# Altium schematic sheet XQuang_ViTri.SchDoc
size A1
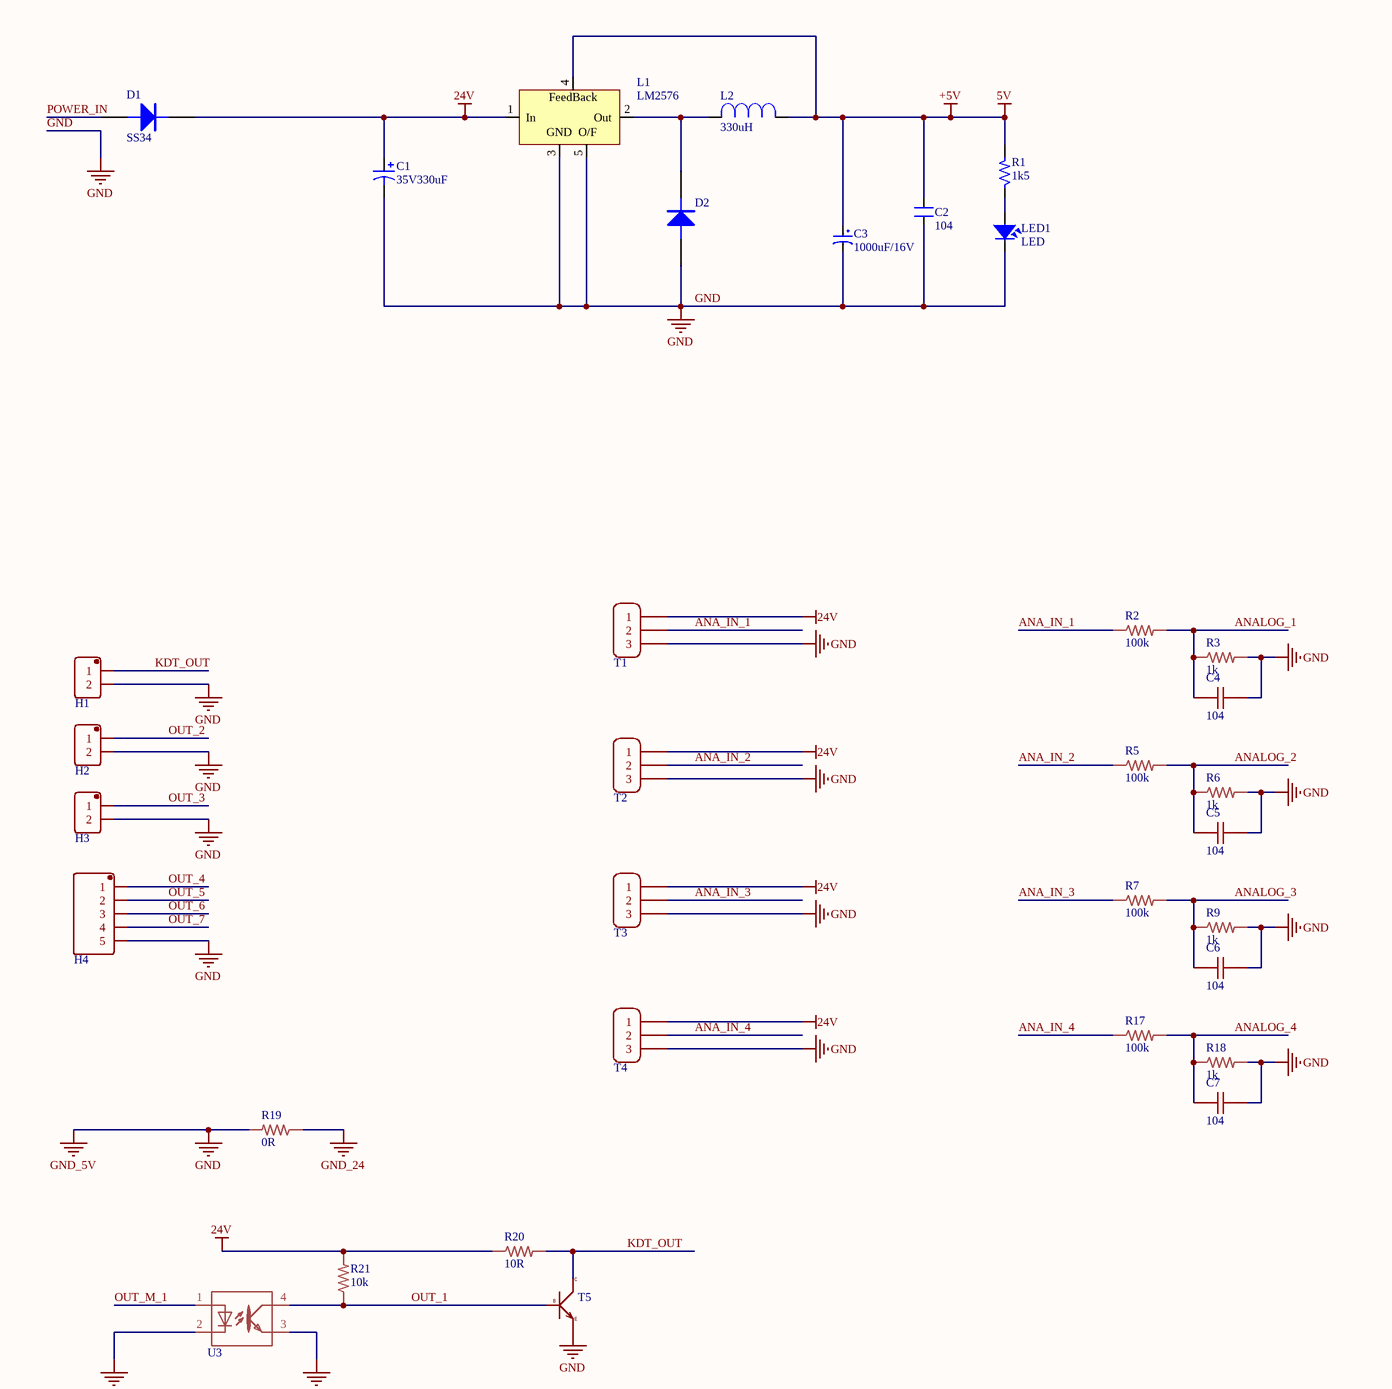
[diagram p0: XQuang_ViTri.SchDoc, top left]
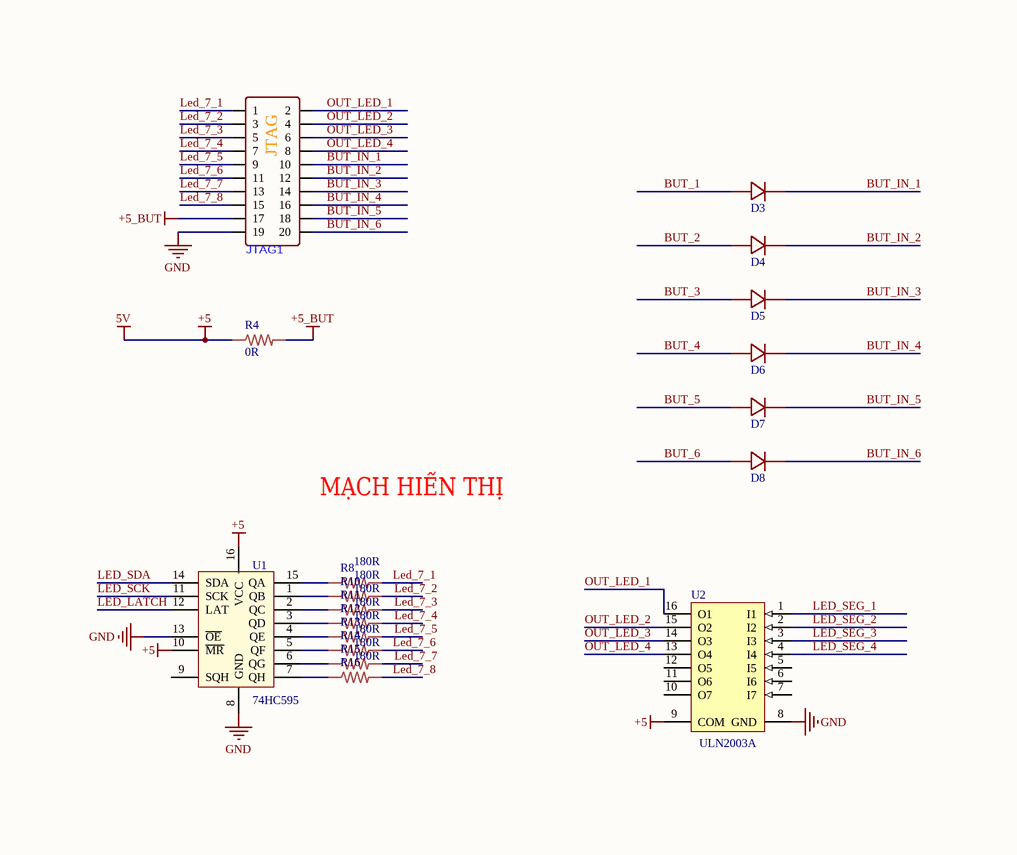
[diagram p1: XQuang_ViTri.SchDoc, top right]
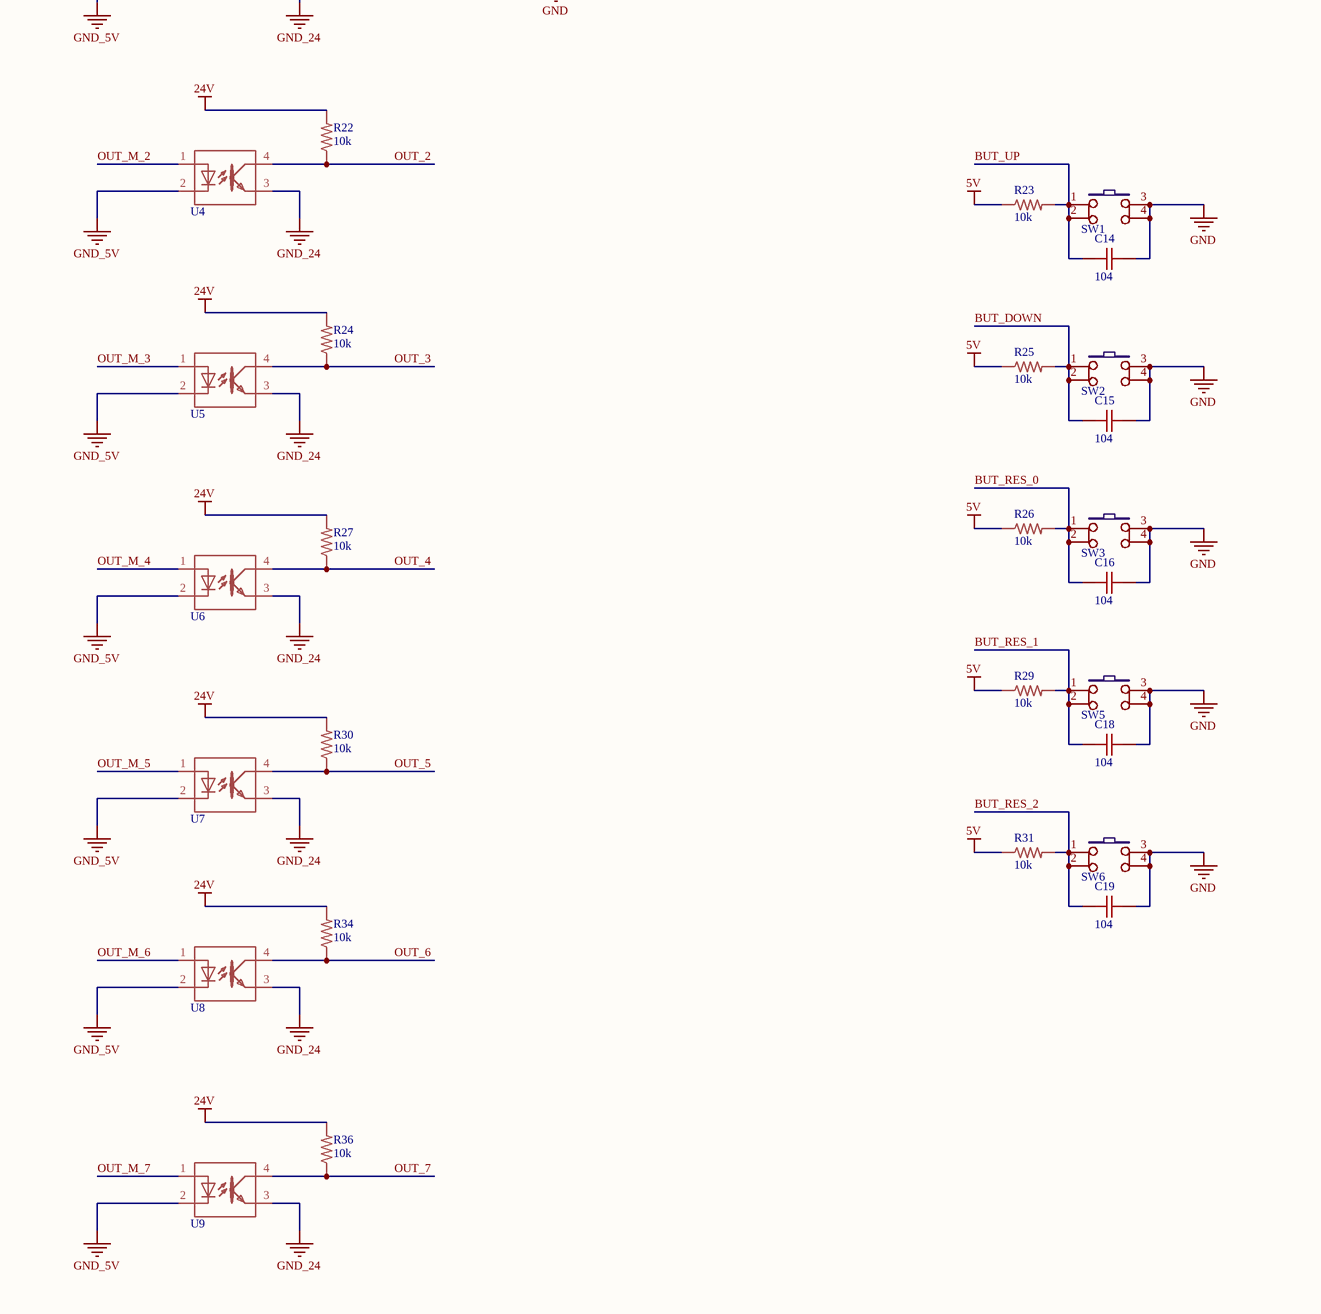
[diagram p2: XQuang_ViTri.SchDoc, bottom left]
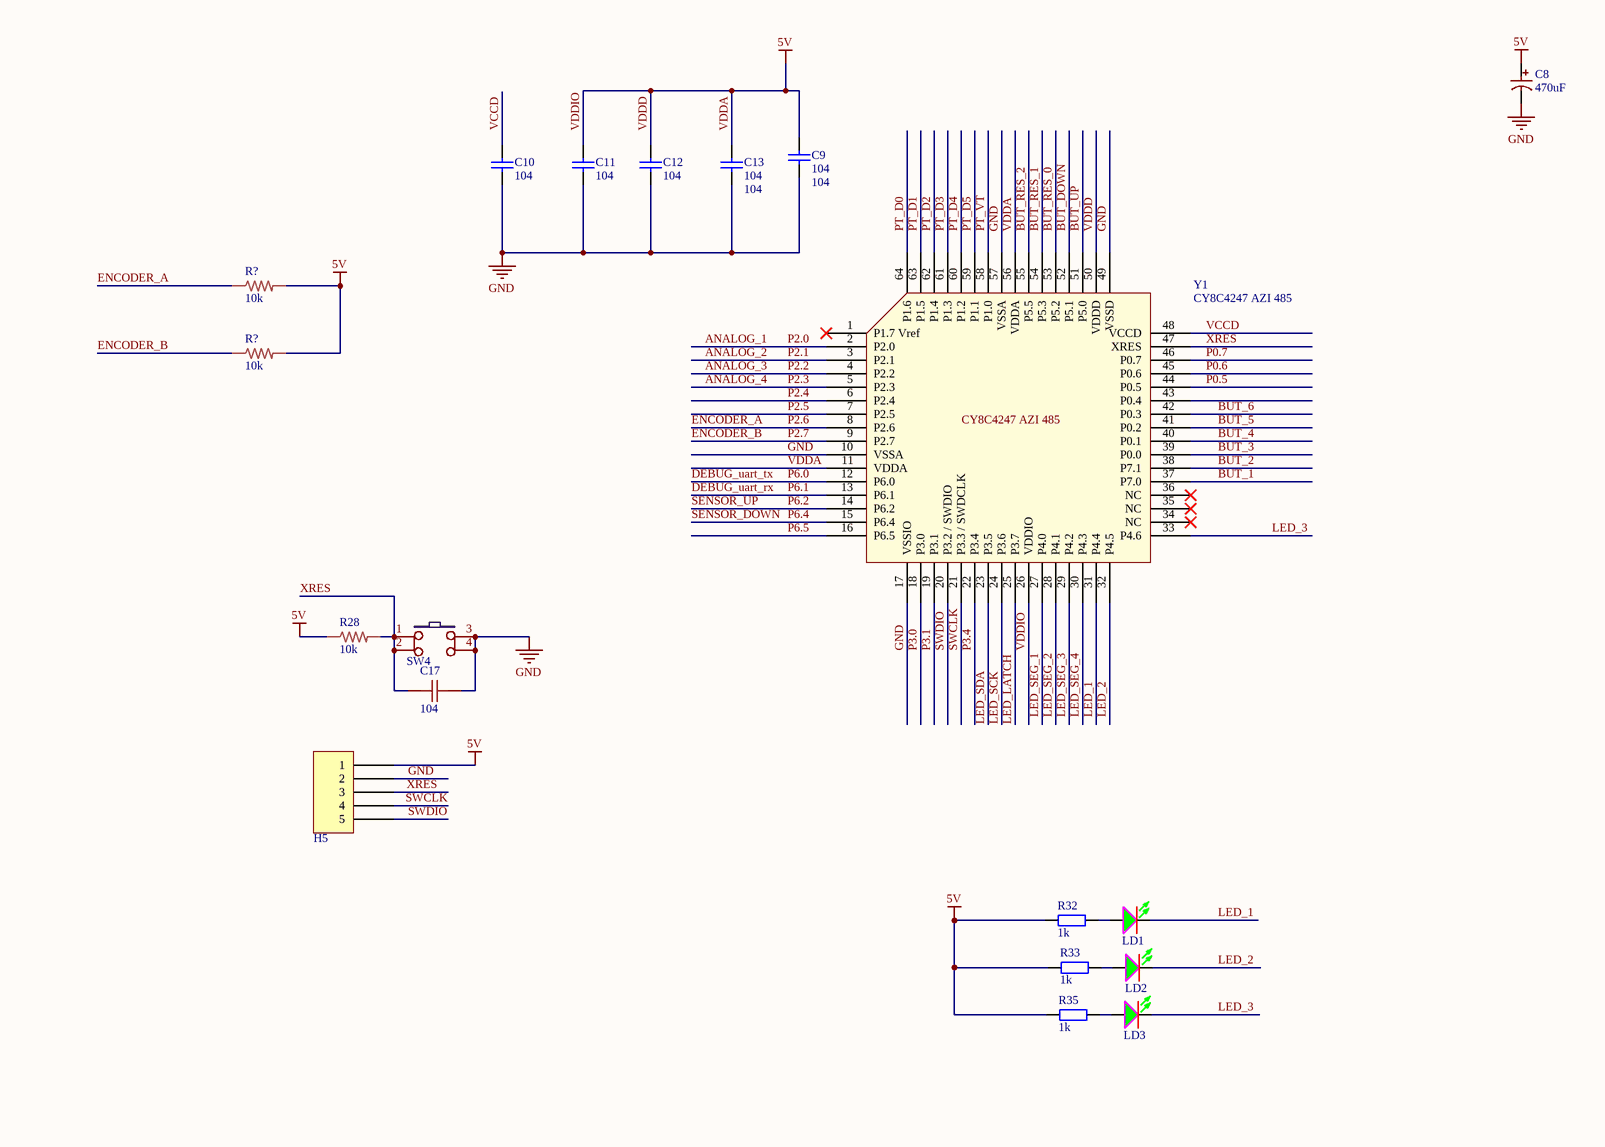
[diagram p3: XQuang_ViTri.SchDoc, bottom right]

## Parts
(Parts that share a designator on the sheet are numbered #1, #2 ... from top to bottom, then left to right.)
C1  35V330uF  [CAP POLY 220UF 16V]
C2  104  [Cap Non Pol 0805]
C3  1000uF/16V  [CAP-ALU-SMD-F]
C4  value 104  [CAP_SMD_1206]  (hidden comment: Cap_SMD)
C5  value 104  [CAP_SMD_1206]  (hidden comment: Cap_SMD)
C6  value 104  [CAP_SMD_1206]  (hidden comment: Cap_SMD)
C7  value 104  [CAP_SMD_1206]  (hidden comment: Cap_SMD)
C8  value 470uF  [Cap_Alu_470uF]  (hidden comment: Cap_Alu_470uF)
C9  104  [Cap_SMD_0805]
C10  104  [C0805]
C11  104  [C0805]
C12  104  [C0805]
C13  104  [Cap_SMD_0805]
C14  value 104  [CAP_SMD_1206]  (hidden comment: Cap_SMD)
C15  value 104  [CAP_SMD_1206]  (hidden comment: Cap_SMD)
C16  value 104  [CAP_SMD_1206]  (hidden comment: Cap_SMD)
C17  value 104  [CAP_SMD_1206]  (hidden comment: Cap_SMD)
C18  value 104  [CAP_SMD_1206]  (hidden comment: Cap_SMD)
C19  value 104  [CAP_SMD_1206]  (hidden comment: Cap_SMD)
D1  SS34  [SMB]
D2  (no value)  [SMA_ss56]
D3  1N4007  [Diode M7]  (value not drawn)
D4  1N4007  [Diode M7]  (value not drawn)
D5  1N4007  [Diode M7]  (value not drawn)
D6  1N4007  [Diode M7]  (value not drawn)
D7  1N4007  [Diode M7]  (value not drawn)
D8  1N4007  [Diode M7]  (value not drawn)
H1  Terminal2x5.08  [EDG2P508]  (value not drawn)
H2  Terminal2x5.08  [EDG2P508]  (value not drawn)
H3  Terminal2x5.08  [EDG2P508]  (value not drawn)
H4  Terminal5x5.08  [EDG5P508]  (value not drawn)
H5  Header 5  [Header 5]  (value not drawn)
JTAG1  JTAG  [JTAG_NG]  (value not drawn)
L1  LM2576  [LM2576_SMD]
L2  value 330uH  [Inductor DR127]  (hidden comment: Inductor DR127)
LD1  LED SMD  [LED3]  (value not drawn)
LD2  LED SMD  [LED3]  (value not drawn)
LD3  LED SMD  [LED3]  (value not drawn)
LED1  LED  [LED 1206/3216 BLUE]
R1  1k5  [Resistor 0805]
R2  value 100k  [Res_SMD_1206]  (hidden comment: Res_SMD)
R3  value 1k  [Res_SMD_1206]  (hidden comment: Res_SMD)
R4  value 0R  [Res_SMD_1206]  (hidden comment: Res_SMD)
R5  value 100k  [Res_SMD_1206]  (hidden comment: Res_SMD)
R6  value 1k  [Res_SMD_1206]  (hidden comment: Res_SMD)
R7  value 100k  [Res_SMD_1206]  (hidden comment: Res_SMD)
R8  value 180R  [Res_SMD_1206]  (hidden comment: Res_SMD)
R9  value 1k  [Res_SMD_1206]  (hidden comment: Res_SMD)
R10  value 180R  [Res_SMD_1206]  (hidden comment: Res_SMD)
R11  value 180R  [Res_SMD_1206]  (hidden comment: Res_SMD)
R12  value 180R  [Res_SMD_1206]  (hidden comment: Res_SMD)
R13  value 180R  [Res_SMD_1206]  (hidden comment: Res_SMD)
R14  value 180R  [Res_SMD_1206]  (hidden comment: Res_SMD)
R15  value 180R  [Res_SMD_1206]  (hidden comment: Res_SMD)
R16  value 180R  [Res_SMD_1206]  (hidden comment: Res_SMD)
R17  value 100k  [Res_SMD_1206]  (hidden comment: Res_SMD)
R18  value 1k  [Res_SMD_1206]  (hidden comment: Res_SMD)
R19  value 0R  [Res_SMD_1206]  (hidden comment: Res_SMD)
R20  value 10R  [RES_SMD_2512]  (hidden comment: Res_SMD)
R21  value 10k  [Res_SMD_1206]  (hidden comment: Res_SMD)
R22  value 10k  [Res_SMD_1206]  (hidden comment: Res_SMD)
R23  value 10k  [Res_SMD_1206]  (hidden comment: Res_SMD)
R24  value 10k  [Res_SMD_1206]  (hidden comment: Res_SMD)
R25  value 10k  [Res_SMD_1206]  (hidden comment: Res_SMD)
R26  value 10k  [Res_SMD_1206]  (hidden comment: Res_SMD)
R27  value 10k  [Res_SMD_1206]  (hidden comment: Res_SMD)
R28  value 10k  [Res_SMD_1206]  (hidden comment: Res_SMD)
R29  value 10k  [Res_SMD_1206]  (hidden comment: Res_SMD)
R30  value 10k  [Res_SMD_1206]  (hidden comment: Res_SMD)
R31  value 10k  [Res_SMD_1206]  (hidden comment: Res_SMD)
R32  1k  [Res_SMD_0805]
R33  1k  [Res_SMD_0805]
R34  value 10k  [Res_SMD_1206]  (hidden comment: Res_SMD)
R35  1k  [Res_SMD_0805]
R36  value 10k  [Res_SMD_1206]  (hidden comment: Res_SMD)
R?#1  value 10k  [Res_SMD_1206]  (hidden comment: Res_SMD)
R?#2  value 10k  [Res_SMD_1206]  (hidden comment: Res_SMD)
SW1  Button6x6  [Button6x6smd]  (value not drawn)
SW2  Button6x6  [Button6x6smd]  (value not drawn)
SW3  Button6x6  [Button6x6smd]  (value not drawn)
SW4  Button6x6  [Button6x6smd]  (value not drawn)
SW5  Button6x6  [Button6x6smd]  (value not drawn)
SW6  Button6x6  [Button6x6smd]  (value not drawn)
T1  Terminal B 3P  [Terminal-3p-381]  (value not drawn)
T2  Terminal B 3P  [Terminal-3p-381]  (value not drawn)
T3  Terminal B 3P  [Terminal-3p-381]  (value not drawn)
T4  Terminal B 3P  [Terminal-3p-381]  (value not drawn)
T5  TIP41C  [TO252]  (value not drawn)
U1  74HC595  [Sop16pin]
U2  ULN2003A  [SO-16]
U3  PC817  [PC817]  (value not drawn)
U4  PC817  [PC817]  (value not drawn)
U5  PC817  [PC817]  (value not drawn)
U6  PC817  [PC817]  (value not drawn)
U7  PC817  [PC817]  (value not drawn)
U8  PC817  [PC817]  (value not drawn)
U9  PC817  [PC817]  (value not drawn)
Y1  CY8C4247 AZI 485  [CY8C4247 AZI]

## Nets
24V: C1.1 D1.2 L1.1(In) R20.1 R21.2 R22.2 R24.2 R27.2 R30.2 R34.2 R36.2 T1.1 T2.1 T3.1 T4.1
+5_BUT: JTAG1.17 R4.2
GND: C1.2 C2.1 C3.2 C4.1 C5.1 C6.1 C7.1 C8.2 C9.2 C10.2 C11.2 C12.2 C13.2 C14.1 C15.1 C16.1 C17.1 C18.1 C19.1 D2.1 H1.2 H2.2 H3.2 H4.5 H5.2 JTAG1.19 L1.3(GND) L1.5(~{O}/F) LED1.2 R3.2 R6.2 R9.2 R18.2 R19.2 SW1.3 SW1.4 SW2.3 SW2.4 SW3.3 SW3.4 SW4.3 SW4.4 SW5.3 SW5.4 SW6.3 SW6.4 T1.3 T2.3 T3.3 T4.3 T5.3(C) U1.8(GND) U1.13(~{OE}) U2.8(GND) U3.2(C) U4.2(C) U5.2(C) U6.2(C) U7.2(C) U8.2(C) U9.2(C) Y1.10(VSSA) Y1.17(VSSIO) Y1.49(VSSD) Y1.57(VSSA)  [also labelled GND_5V]
GND_24: R19.1 U3.3(EMIT) U4.3(EMIT) U5.3(EMIT) U6.3(EMIT) U7.3(EMIT) U8.3(EMIT) U9.3(EMIT)
VDDA: C2.2 C3.1 C8.1 C9.1 C11.1 C12.1 C13.1 H5.1 L1.4 L2.1 R1.2 R4.1 R23.1 R25.1 R26.1 R28.1 R29.1 R31.1 R32.2 R33.2 R35.2 R?#1.2 R?#2.2 U1.10(~{MR}) U1.16(VCC) U2.9(COM) Y1.11(VDDA) Y1.26(VDDIO) Y1.50(VDDD) Y1.56(VDDA)  [also labelled +5, +5V, 5V, VDDD, VDDIO]
ANA_IN_1: R2.1 T1.2
ANA_IN_2: R5.1 T2.2
ANA_IN_3: R7.1 T3.2
ANA_IN_4: R17.1 T4.2
ANALOG_1: C4.2 R2.2 R3.1 Y1.2(P2.0)  [also labelled P2.0]
ANALOG_2: C5.2 R5.2 R6.1 Y1.3(P2.1)  [also labelled P2.1]
ANALOG_3: C6.2 R7.2 R9.1 Y1.4(P2.2)  [also labelled P2.2]
ANALOG_4: C7.2 R17.2 R18.1 Y1.5(P2.3)  [also labelled P2.3]
BUT_1: D3.1(A) Y1.37(P7.0)
BUT_2: D4.1(A) Y1.38(P7.1)
BUT_3: D5.1(A) Y1.39(P0.0)
BUT_4: D6.1(A) Y1.40(P0.1)
BUT_5: D7.1(A) Y1.41(P0.2)
BUT_6: D8.1(A) Y1.42(P0.3)
BUT_DOWN: C15.2 R25.2 SW2.1 SW2.2 Y1.52(P5.1)
BUT_IN_1: D3.2(K) JTAG1.10
BUT_IN_2: D4.2(K) JTAG1.12
BUT_IN_3: D5.2(K) JTAG1.14
BUT_IN_4: D6.2(K) JTAG1.16
BUT_IN_5: D7.2(K) JTAG1.18
BUT_IN_6: D8.2(K) JTAG1.20
BUT_RES_0: C16.2 R26.2 SW3.1 SW3.2 Y1.53(P5.2)
BUT_RES_1: C18.2 R29.2 SW5.1 SW5.2 Y1.54(P5.3)
BUT_RES_2: C19.2 R31.2 SW6.1 SW6.2 Y1.55(P5.5)
BUT_UP: C14.2 R23.2 SW1.1 SW1.2 Y1.51(P5.0)
DEBUG_uart_rx: Y1.13(P6.1)  [also labelled P6.1]
DEBUG_uart_tx: Y1.12(P6.0)  [also labelled P6.0]
ENCODER_A: R?#1.1 Y1.8(P2.6)  [also labelled P2.6]
ENCODER_B: R?#2.1 Y1.9(P2.7)  [also labelled P2.7]
KDT_OUT: H1.1 R20.2 T5.2(E)
LED_1: LD1.2(K) Y1.31(P4.4)
LED_2: LD2.2(K) Y1.32(P4.5)
LED_3: LD3.2(K) Y1.33(P4.6)
Led_7_1: JTAG1.1 R8.2
Led_7_2: JTAG1.3 R10.2
Led_7_3: JTAG1.5 R11.2
Led_7_4: JTAG1.7 R12.2
Led_7_5: JTAG1.9 R13.2
Led_7_6: JTAG1.11 R14.2
Led_7_7: JTAG1.13 R15.2
Led_7_8: JTAG1.15 R16.2
LED_LATCH: U1.12(LAT) Y1.25(P3.7)
LED_SCK: U1.11(SCK) Y1.24(P3.6)
LED_SDA: U1.14(SDA) Y1.23(P3.5)
LED_SEG_1: U2.1(I1) Y1.27(P4.0)
LED_SEG_2: U2.2(I2) Y1.28(P4.1)
LED_SEG_3: U2.3(I3) Y1.29(P4.2)
LED_SEG_4: U2.4(I4) Y1.30(P4.3)
OUT_1: R21.1 T5.1(B) U3.4(COL)
OUT_2: H2.1 R22.1 U4.4(COL)
OUT_3: H3.1 R24.1 U5.4(COL)
OUT_4: H4.1 R27.1 U6.4(COL)
OUT_5: H4.2 R30.1 U7.4(COL)
OUT_6: H4.3 R34.1 U8.4(COL)
OUT_7: H4.4 R36.1 U9.4(COL)
OUT_LED_1: JTAG1.2 U2.16(O1)
OUT_LED_2: JTAG1.4 U2.15(O2)
OUT_LED_3: JTAG1.6 U2.14(O3)
OUT_LED_4: JTAG1.8 U2.13(O4)
OUT_M_1: U3.1(A)
OUT_M_2: U4.1(A)
OUT_M_3: U5.1(A)
OUT_M_4: U6.1(A)
OUT_M_5: U7.1(A)
OUT_M_6: U8.1(A)
OUT_M_7: U9.1(A)
P0.5: Y1.44(P0.5)
P0.6: Y1.45(P0.6)
P0.7: Y1.46(P0.7)
P2.4: Y1.6(P2.4)
P2.5: Y1.7(P2.5)
P3.0: Y1.18(P3.0)
P3.1: Y1.19(P3.1)
P3.4: Y1.22(P3.4)
P6.2: Y1.14(P6.2)  [also labelled SENSOR_UP]
P6.4: Y1.15(P6.4)  [also labelled SENSOR_DOWN]
P6.5: Y1.16(P6.5)
POWER_IN: D1.1
PT_D0: Y1.64(P1.6)
PT_D1: Y1.63(P1.5)
PT_D2: Y1.62(P1.4)
PT_D3: Y1.61(P1.3)
PT_D4: Y1.60(P1.2)
PT_D5: Y1.59(P1.1)
PT_VT: Y1.58(P1.0)
SWCLK: H5.4 Y1.21(P3.3_/_SWDCLK)
SWDIO: H5.5 Y1.20(P3.2_/_SWDIO)
VCCD: C10.1 Y1.48(VCCD)
XRES: C17.2 H5.3 R28.2 SW4.1 SW4.2 Y1.47(XRES)
NetD2_2: D2.2 L1.2(Out) L2.2
NetLD1_1: LD1.1(A) R32.1
NetLD2_1: LD2.1(A) R33.1
NetLD3_1: LD3.1(A) R35.1
NetLED1_1: LED1.1 R1.1
NetR8_1: R8.1 U1.15(QA)
NetR10_1: R10.1 U1.1(QB)
NetR11_1: R11.1 U1.2(QC)
NetR12_1: R12.1 U1.3(QD)
NetR13_1: R13.1 U1.4(QE)
NetR14_1: R14.1 U1.5(QF)
NetR15_1: R15.1 U1.6(QG)
NetR16_1: R16.1 U1.7(QH)

Not connected (* = marked no-connect by the designer): U1 9(SQH); U2 5(I5) 6(I6) 7(I7) 10(O7) 11(O6) 12(O5); Y1 1(P1.7_Vref)* 34(NC)* 35(NC)* 36(NC)* 43(P0.4)

## Notes on the sheet
- MẠCH HIỂN THỊ
- Title
- Size:
- Date:
- File:
- A1
- Number:
- Time:
- Revision:
- Sheet
- of
- (in symbol LM2576) FeedBack; O/F

## Library data of the parts
C1 = Cap Pol1: Polarized Capacitor (Radial); Published: 8-Jun-2000; LatestRevisionDate: 17-Jul-2002; LatestRevisionNote: Re-released for DXP Platform.; PackageReference: RB7.6-15; Publisher: Altium Limited; PackageDescription: Polarized Capacitor (Radial); 2 Leads
C2 = CM: Cap SMD; Value: 103
C3 = CP4: Cap 1000uF/16V - 220uF/50V; Description 5: 4,7uF>10uF/250V_3,3uF>10uF/400V - 2,2uF>4,7uF/450V; Description 1: 2200uF-3300uF/6,3V - 1000uF-2200uF/10V; Description 2: 1000uF/16V - 470uF => 1000uF/25V - 100uF/100V; Description 3: 330uF>470uF/35V_220uF>470uF/50V_10uF>22uF/250V; Description 4: 220uF => 330uF/63V - 10uF =>33uF/160 - 200V; Value: 1000uF/16V
C4-C7 C14-C19 = Cap_SMD: Cap SMD multiple types as 0402 0603 0805 1206
C8 = Cap_Alu_470uF: Cap aluminum 470uF
C9-C13 = Cap: Capacitor; Published: 8-Jun-2000; LatestRevisionDate: 17-Jul-2002; LatestRevisionNote: Re-released for DXP Platform.; PackageReference: RAD-0.3; Publisher: Altium Limited; PackageDescription: Radial Cap, Thru-Hole; 2 Leads; 0.3 in Pin Spacing; Value: 104
D1 D2 = DIODE
D3-D8 = 1N4007: diode SMD M7
H1-H3 = Terminal2x5.08: terminal 5.08mm x2 pins
H4 = Terminal5x5.08: terminal edg 5.08mm 5 pins
JTAG1 = JTAG: JTAG 20 pins
L2 = Inductor DR127: Inductor SMD DR127 - 12.5mm
LD1-LD3 = LED SMD: LED DIFFUSED SMD
LED1 = LED: LED Single colour Green and Red; Value: LED 3 ly Single Colour
R1 = R: Resistor 1/4W; Value: R1/4W - 1K
R2-R31 R34 R36 R?#1 R?#2 = Res_SMD: res smd
R32 R33 R35 = Tro 0805 1% 10k: Dán; Don_Vi: Con; So_Chan: 2; Ten_Linh_Kien: Trở 0805 1% 10k; Ma_Hang: MH005473; Chung_Loai: Dán; Kieu_Chan: *
SW1-SW6 = Button6x6: button 6x6 mm
T1-T4 = Terminal B 3P: Terminal Block 3 pins
T5 = TIP41C: Transistor NPN
U1 = 74595: 8 Bit Serial input - Parallel Output; Value: 74HC595
U2 = ULN2003A: High-Voltage, High-Current Darlington Array; LatestRevisionNote: Stylized 3D Model Added.; Publisher: Altium Limited; Value: ULN2003A
U3-U9 = PC817: IC opto